# Altium schematic sheet Charger_group2.SchDoc
size A4; SheetNumber: 1; SheetTotal: 1
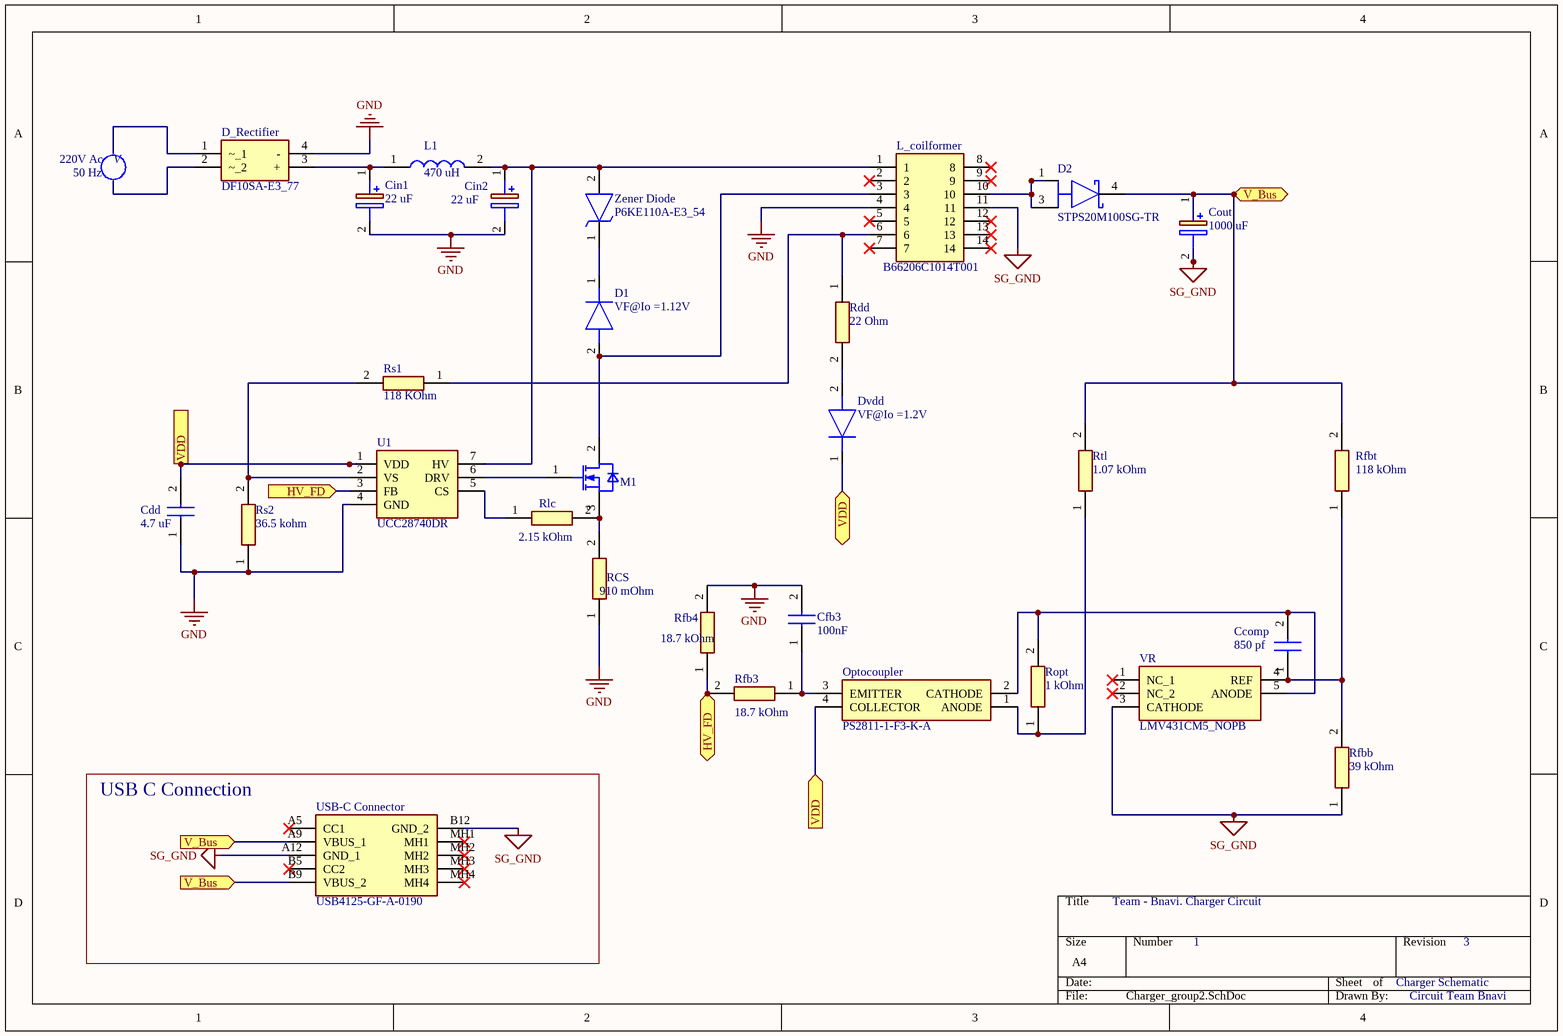
[diagram p0: Charger_group2.SchDoc]

## Parts
Ccomp  850 pf  [CAPC1608X90N]
Cdd  4.7 uF  [CAPC2012X145N]
Cfb3  100nF  [CAPC2013X94N]
Cin1  22 uF  [CAPPRD500W60D1275H2200]
Cin2  22 uF  [CAPPRD500W60D1275H2200]
Cout  1000 uF  [CAPPRD500W65D1000H2700]
D1  VF@Io =1.12V  [DIOM7959X262N]
D2  STPS20M100SG-TR  [FP-STPS20M100SG-TR-MFG]
D_Rectifier  DF10SA-E3_77  [SOP510P1005X330-4N]
Dvdd  VF@Io =1.2V  [DIOM5436X330N]
L1  470 uH  [WE-PD2_105455]
L_coilformer  B66206C1014T001  [B66206C1014T001]
M1  IPD80R1K0CE  [TO229P994X241-3N]  (value not drawn)
Optocoupler  PS2811-1-F3-K-A  [SOIC127P700X210-4N]
RCS  910 mOhm  [RESC2012X60N]
Rdd  22 Ohm  [RESC1608X55N]
Rfb3  18.7 kOhm  [RESC0603X26N]
Rfb4  18.7 kOhm  [RESC0603X26N]
Rfbb  39 kOhm  [RESC1608X55N]
Rfbt  118 kOhm  [RESC1005X40N]
Rlc  2.15 kOhm  [RESC1005X40N]
Ropt  1 kOhm  [RESC1005X40N]
Rs1  118 KOhm  [RESC1005X40N]
Rs2  36.5 kohm  [RESC0603X26N]
Rtl  1.07 kOhm  [RESC1005X40N]
U1  UCC28740DR  [D(R-PDSO-G7)]
USB-C_Connector  USB4125-GF-A-0190  [USB4125GFA0190]
VR  LMV431CM5_NOPB  [SOT95P280X145-5N]
Zener_Diode  P6KE110A-E3_54  [DIOAD1995W86L635D340]

## Blocks framed on the sheet
USB C Connection: USB-C_Connector

## Ports
HV_FD (bidir), HV_FD (in), V_Bus (bidir), V_Bus (in), VDD (bidir), VDD (in)

## Nets
GND: Cdd.1 Cfb3.2(C2) Cin1.2(-) Cin2.2(-) D_Rectifier.4(-) L_coilformer.4 RCS.1 Rfb4.2 Rs2.1 U1.4(GND)
SG_GND: Cout.2(-) L_coilformer.11 Rfbb.1 USB-C_Connector.A12(GND_1) USB-C_Connector.B12(GND_2) VR.3(CATHODE)
HV_FD: Rfb3.2 Rfb4.1 U1.3(FB) ; port HV_FD
V_Bus: Cout.1(+) D2.4(K) Rfbt.2 Rtl.2 USB-C_Connector.A9(VBUS_1) USB-C_Connector.B9(VBUS_2) ; port V_Bus
VDD: Cdd.2 Dvdd.1(K) Optocoupler.4(COLLECTOR) U1.1(VDD) ; port VDD
NetCcomp_1: Ccomp.1 Rfbb.2 Rfbt.1 VR.4(REF)
NetCcomp_2: Ccomp.2 Optocoupler.2(CATHODE) Ropt.2 VR.5(ANODE)
NetCfb3_1: Cfb3.1(C1) Optocoupler.3(EMITTER) Rfb3.1
NetCin1_1: Cin1.1(+) D_Rectifier.3(+) L1.1
NetCin2_1: Cin2.1(+) L1.2 L_coilformer.1 U1.7(HV) Zener_Diode.2(A)
NetD1_1: D1.1(K) Zener_Diode.1(K)
NetD1_2: D1.2(A) L_coilformer.3 M1.2(DRAIN)
NetD2_1: D2.1(A) D2.3(A) L_coilformer.10
NetDvdd_2: Dvdd.2(A) Rdd.2
NetL_coilformer_6: L_coilformer.6 Rdd.1 Rs1.1
NetM1_1: M1.1(GATE) U1.6(DRV)
NetM1_3: M1.3(SOURCE) RCS.2 Rlc.2
NetOptocoupler_1: Optocoupler.1(ANODE) Ropt.1 Rtl.1
NetRlc_1: Rlc.1 U1.5(CS)
NetRs1_2: Rs1.2 Rs2.2 U1.2(VS)

Not connected (* = marked no-connect by the designer): D_Rectifier 1(~_1) 2(~_2); L_coilformer 2* 5* 7* 8* 9* 12* 13* 14*; USB-C_Connector A5(CC1)* B5(CC2)* MH1* MH2* MH3* MH4*; VR 1(NC_1)* 2(NC_2)*

## Notes on the sheet
- 220V Ac
- 50 Hz
- V
- Team - Bnavi. Charger Circuit
- 1
- Charger Schematic
- 3
- Circuit Team Bnavi

## Library data of the parts
Ccomp = 06031C851JAT2A: Capacitor; Manufacturer_Name: AVX; Datasheet Link: https://componentsearchengine.com/Datasheets/1/06031A100FAT2A.pdf; Height: 0.9mm; Manufacturer_Part_Number: 06031C851JAT2A; Mouser Part Number: 581-06031C851JAT2A; Mouser Price/Stock: https://www.mouser.co.uk/ProductDetail/AVX/06031C851JAT2A?qs=Q0wCMCRSJ1uRTlT%2F3ACAEg%3D%3D
Cdd = CGA4J1X7R1V475K125AC: Capacitor; Manufacturer_Name: TDK; Datasheet Link: https://product.tdk.com/system/files/dam/doc/product/capacitor/ceramic/mlcc/catalog/mlcc_automotive_general_en.pdf; Height: 1.45mm; Manufacturer_Part_Number: CGA4J1X7R1V475K125AC; Mouser Part Number: 810-CGA4J1X7R1V475KC; Mouser Price/Stock: https://www.mouser.co.uk/ProductDetail/TDK/CGA4J1X7R1V475K125AC/?qs=xLDY6iXSiQZ6d6YyEJDECQ%3D%3D; Arrow Part Number: CGA4J1X7R1V475K125AC; Arrow Price/Stock: https://www.arrow.com/en/products/cga4j1x7r1v475k125ac/tdk
Cfb3 = 08053C104JAZ2A: Capacitor; Manufacturer_Name: AVX; Manufacturer_Part_Number: 08053C104JAZ2A; Mouser Part Number: 581-08053C104JAZ2A; Mouser Price/Stock: https://www.mouser.co.uk/ProductDetail/AVX/08053C104JAZ2A?qs=YtXa1zY%252Bjw7108MDhSwtdw%3D%3D; Arrow Part Number: 08053C104JAZ2A; Arrow Price/Stock: https://www.arrow.com/en/products/08053c104jaz2a/avx
Cin1 Cin2 = 400PK22MEFC12.5X20: Capacitor Polarised; Manufacturer_Name: Rubycon; Datasheet Link: http://www.rubycon.co.jp/en/catalog/e_pdfs/aluminum/e_pk.pdf; Height: 22mm; Manufacturer_Part_Number: 400PK22MEFC12.5X20; Mouser Part Number: 232-400PK22MEFC125X2; Mouser Price/Stock: https://www.mouser.co.uk/ProductDetail/Rubycon/400PK22MEFC12.5X20?qs=T3oQrply3y%252B1A0DQVCmdTw%3D%3D
Cout = EEU-FC1C102: Capacitor Polarised; Manufacturer_Name: Panasonic; Datasheet Link: http://industrial.panasonic.com/cdbs/www-data/pdf/RDF0000/ABA0000C1209.pdf; Height: 27mm; Manufacturer_Part_Number: EEU-FC1C102; Mouser Part Number: 667-EEU-FC1C102; Mouser Price/Stock: https://www.mouser.co.uk/ProductDetail/Panasonic/EEU-FC1C102/?qs=bcjYS4nEpcecXuFNFyrCMQ%3D%3D; Arrow Part Number: EEU-FC1C102; Arrow Price/Stock: https://www.arrow.com/en/products/eeu-fc1c102/panasonic
D1 = CD214C-F3600: Diode; Manufacturer_Name: Bourns; Datasheet Link: https://datasheet.datasheetarchive.com/originals/distributors/SFDatasheet-7/sf-000140118.pdf; Height: 2.62mm; Manufacturer_Part_Number: CD214C-F3600; Mouser Part Number: 652-CD214C-F3600; Mouser Price/Stock: https://www.mouser.co.uk/ProductDetail/Bourns/CD214C-F3600?qs=TkkmMb5HBbQTesSVRPXLkQ%3D%3D; Arrow Part Number: CD214C-F3600; Arrow Price/Stock: https://www.arrow.com/en/products/cd214c-f3600/bourns
D2 = CMP-12187-000010-1: DIODE SCHOTTKY 100V 20A D2PAK; Manufacturer: STMicroelectronics; Peak Reverse Current: 10uA; Max Junction Temp: +150°C; Standoff Height: 0mm; Max Surge Forward Current: 350A; Forward Current: 20A; Temperature: to +150°C; Device Class L3: Schottky Diodes; Temperature Range High: +150°C; Device Class L1: Discrete Semiconductors; Mouser Description: Schottky Diodes & Rectifiers 20A 100V; Category: Diode; Max Repetitive Reverse Voltage: 100V; ComponentLink2Description: Datasheet; RoHS: TRUE; ComponentLink2URL: https://www.st.com/resource/en/datasheet/stps20m100s.pdf; Octopart: https://octopart.com/stps20m100sg-tr-stmicroelectronics-17669033; Lead Free: Yes; Package: STPS20M100SG-TR; Height: 4.85mm; Device Class L2: Diodes; Automotive: No; Digikey Description: DIODE SCHOTTKY 100V 20A D2PAK; Manufacturer Part Number: STPS20M100SG-TR
D_Rectifier = DF10SA-E3_77: Diode; Manufacturer_Name: Vishay; Manufacturer_Part_Number: DF10SA-E3/77; Datasheet Link: http://uk.rs-online.com/web/p/products/7005403; Height: 3.3mm; Mouser Part Number: 625-DF10SA-E3; Mouser Price/Stock: https://www.mouser.co.uk/ProductDetail/Vishay-General-Semiconductor/DF10SA-E3-77?qs=lTgc38YOCCojApEJ5g6z7g%3D%3D; Arrow Part Number: DF10SA-E3/77; Arrow Price/Stock: https://www.arrow.com/en/products/df10sa-e377/vishay?region=nac
Dvdd = UFS180Je3_TR13: Diode; Manufacturer_Name: Microsemi Corporation; Manufacturer_Part_Number: UFS180Je3/TR13; Datasheet Link: https://media.digikey.com/pdf/Data%20Sheets/Microsemi%20PDFs/UFS160J-UFS180J.pdf; Height: 3.3mm; Mouser Part Number: 494-UFS180JE3/TR13; Mouser Price/Stock: https://www.mouser.co.uk/ProductDetail/Microchip-Microsemi/UFS180Je3-TR13?qs=pU29NIZ4ZwBQwIY5BrOkmA%3D%3D; Arrow Part Number: UFS180JE3/TR13; Arrow Price/Stock: https://www.arrow.com/en/products/ufs180je3tr13/microsemi
L1 = 744776247: Inductor; Manufacturer_Name: Wurth Elektronik; Manufacturer_Part_Number: 744776247; Mouser Part Number: 710-744776247; Mouser Price/Stock: https://www.mouser.com/Search/Refine.aspx?Keyword=710-744776247
L_coilformer = B66206C1014T001: Inductor; Manufacturer_Name: TDK; Datasheet Link: https://product.tdk.com/system/files/dam/doc/product/ferrite/ferrite/ferrite-acc/data_sheet/80/db/fer/e_20_10_6.pdf; Height: 13.9mm; Manufacturer_Part_Number: B66206C1014T001
M1 = IPD80R1K0CE: CoolMos CE 800V Power Transistor; Manufacturer: Infineon Technologies; ManufacturerPartNumber: IPD80R1K0CE; PackageReference: PG-TO252 (DPAK)
Optocoupler = PS2811-1-F3-K-A: Integrated Circuit; Manufacturer_Name: CEL; Datasheet Link: https://datasheet.datasheetarchive.com/originals/distributors/Datasheets_SAMA/e00520b14130937508b53ebe3d73e62e.pdf; Height: 2.1mm; Manufacturer_Part_Number: PS2811-1-F3-K-A; Mouser Part Number: 551-PS2811-1-F3-K-A; Mouser Price/Stock: https://www.mouser.com/Search/Refine.aspx?Keyword=551-PS2811-1-F3-K-A; Arrow Part Number: PS2811-1-F3-K-A; Arrow Price/Stock: https://www.arrow.com/en/products/ps2811-1-f3-k-a/california-eastern-laboratories
RCS = CRM0805-FX-R910ELF: Resistor; Manufacturer_Name: Bourns; Datasheet Link: http://www.bourns.com/data/global/pdfs/CRM0805_1206_2010.pdf; Height: 0.6mm; Manufacturer_Part_Number: CRM0805-FX-R910ELF; Mouser Part Number: 652-CRM0805FXR910ELF; Mouser Price/Stock: https://www.mouser.co.uk/ProductDetail/Bourns/CRM0805-FX-R910ELF?qs=%2FxfeZyN5VBe746z4RDJfyw%3D%3D; Arrow Part Number: CRM0805-FX-R910ELF; Arrow Price/Stock: https://www.arrow.com/en/products/crm0805-fx-r910elf/bourns
Rdd = RC0603FR-0722RL: Resistor; Manufacturer_Name: YAGEO; Datasheet Link: http://www.farnell.com/datasheets/1868787.pdf; Height: 0.55mm; Manufacturer_Part_Number: RC0603FR-0722RL; Mouser Part Number: 603-RC0603FR-0722RL; Mouser Price/Stock: https://www.mouser.co.uk/ProductDetail/YAGEO/RC0603FR-0722RL?qs=diQw95jMAeMOsxb8bne7fg%3D%3D
Rfb3 = RC0201FR-07205KL: Resistor; Manufacturer_Name: YAGEO; Datasheet Link: https://www.arrow.com/en/products/rc0201fr-07205kl/yageo?region=nac; Height: 0.26mm; Manufacturer_Part_Number: RC0201FR-07205KL; Mouser Part Number: 603-RC0201FR-07205KL; Mouser Price/Stock: https://www.mouser.co.uk/ProductDetail/YAGEO/RC0201FR-07205KL?qs=Q4gDqC5t5%2FBvVGk%2FbPsM0A%3D%3D; Arrow Part Number: RC0201FR-07205KL; Arrow Price/Stock: https://www.arrow.com/en/products/rc0201fr-07205kl/yageo?region=nac
Rfb4 = RC0201FR-0718K7L: Resistor; Manufacturer_Name: KEMET; Datasheet Link: https://datasheet.datasheetarchive.com/originals/distributors/Datasheets_SAMA/902f9e387b938f871d31120f5fc1d65e.pdf; Height: 0.26mm; Manufacturer_Part_Number: RC0201FR-0718K7L; Mouser Part Number: 603-RC0201FR-0718K7L; Mouser Price/Stock: https://www.mouser.co.uk/ProductDetail/YAGEO/RC0201FR-0718K7L?qs=Q4gDqC5t5%2FBha9qkI2Bozg%3D%3D; Arrow Part Number: RC0201FR-0718K7L; Arrow Price/Stock: https://www.arrow.com/en/products/rc0201fr-0718k7l/yageo?region=nac
Rfbb = RC0603FR-0739KL: Resistor; Manufacturer_Name: KEMET; Datasheet Link: https://datasheet.datasheetarchive.com/originals/distributors/Datasheets_SAMA/902f9e387b938f871d31120f5fc1d65e.pdf; Height: 0.55mm; Manufacturer_Part_Number: RC0603FR-0739KL; Mouser Part Number: 603-RC0603FR-0739KL; Mouser Price/Stock: https://www.mouser.co.uk/ProductDetail/Yageo/RC0603FR-0739KL?qs=diQw95jMAeOP2wB%2FELd%252BCQ%3D%3D
Rfbt Rs1 = CRCW0402118KFKED: Resistor; Manufacturer_Name: Vishay; Datasheet Link: http://www.vishay.com/docs/20035/dcrcwe3.pdf; Height: 0.4mm; Manufacturer_Part_Number: CRCW0402118KFKED; Mouser Part Number: 71-CRCW0402-118K-E3; Mouser Price/Stock: https://www.mouser.co.uk/ProductDetail/Vishay-Dale/CRCW0402118KFKED?qs=rlE3Te1NifzlSy4FZiG4wQ%3D%3D; Arrow Part Number: CRCW0402118KFKED; Arrow Price/Stock: https://www.arrow.com/en/products/crcw0402118kfked/vishay
Rlc = CRCW04022K15FKED: Resistor; Manufacturer_Name: Vishay; Datasheet Link: http://www.vishay.com/docs/20035/dcrcwe3.pdf; Height: 0.4mm; Manufacturer_Part_Number: CRCW04022K15FKED; Mouser Part Number: 71-CRCW0402-2.15K-E3; Mouser Price/Stock: https://www.mouser.co.uk/ProductDetail/Vishay-Dale/CRCW04022K15FKED?qs=hD42E%2F8yzjpq6GeA3TML6Q%3D%3D; Arrow Part Number: CRCW04022K15FKED; Arrow Price/Stock: https://www.arrow.com/en/products/crcw04022k15fked/vishay
Ropt = CRCW04021K00FKEDHP: Resistor; Manufacturer_Name: Vishay; Datasheet Link: http://www.vishay.com/docs/20035/dcrcwe3.pdf; Height: 0.4mm; Manufacturer_Part_Number: CRCW04021K00FKEDHP; Mouser Part Number: 71-CRCW04021K00FKEDH; Mouser Price/Stock: https://www.mouser.co.uk/ProductDetail/Vishay-Dale/CRCW04021K00FKEDHP?qs=FlFvgi4rxBxFJ5cCIk6dAw%3D%3D; Arrow Part Number: CRCW04021K00FKEDHP; Arrow Price/Stock: https://www.arrow.com/en/products/crcw04021k00fkedhp/vishay?region=nac
Rs2 = RC0201FR-0736K5L: Resistor; Manufacturer_Name: KEMET; Datasheet Link: https://datasheet.datasheetarchive.com/originals/distributors/Datasheets_SAMA/902f9e387b938f871d31120f5fc1d65e.pdf; Height: 0.26mm; Manufacturer_Part_Number: RC0201FR-0736K5L; Mouser Part Number: 603-RC0201FR-0736K5L; Mouser Price/Stock: https://www.mouser.co.uk/ProductDetail/YAGEO/RC0201FR-0736K5L?qs=Q4gDqC5t5%2FCjo5Pvwu9LTQ%3D%3D; Arrow Part Number: RC0201FR-0736K5L; Arrow Price/Stock: https://www.arrow.com/en/products/rc0201fr-0736k5l/yageo?region=nac
Rtl = CRCW04021K07FKED: Resistor; Manufacturer_Name: Vishay; Datasheet Link: http://www.vishay.com/docs/20035/dcrcwe3.pdf; Height: 0.4mm; Manufacturer_Part_Number: CRCW04021K07FKED; Mouser Part Number: 71-CRCW0402-1.07K-E3; Mouser Price/Stock: https://www.mouser.co.uk/ProductDetail/Vishay-Dale/CRCW04021K07FKED?qs=YX%252BK5oaHNYowTrxQlLaSFA%3D%3D; Arrow Part Number: CRCW04021K07FKED; Arrow Price/Stock: https://www.arrow.com/en/products/crcw04021k07fked/vishay
U1 = UCC28740DR: Inductor; Manufacturer_Name: Texas Instruments; Datasheet Link: http://www.ti.com/lit/gpn/ucc28740; Manufacturer_Part_Number: UCC28740DR; Mouser Part Number: 595-UCC28740DR; Mouser Price/Stock: https://www.mouser.co.uk/ProductDetail/Texas-Instruments/UCC28740DR?qs=e1ok2LiJcmZNvNsbUBmieA%3D%3D; Arrow Part Number: UCC28740DR; Arrow Price/Stock: https://www.arrow.com/en/products/ucc28740dr/texas-instruments?region=nac
USB-C_Connector = USB4125-GF-A-0190: Connector; Manufacturer_Name: GCT (GLOBAL CONNECTOR TECHNOLOGY); Datasheet Link: https://eu.mouser.com/datasheet/2/837/usb4125-2448699.pdf; Height: 3.41mm; Manufacturer_Part_Number: USB4125-GF-A-0190; Mouser Part Number: 640-USB4125-GF-A-190; Mouser Price/Stock: https://www.mouser.co.uk/ProductDetail/GCT/USB4125-GF-A-0190?qs=QNEnbhJQKvbCz4hEJBS24w%3D%3D
VR = LMV431CM5_NOPB: Integrated Circuit; Manufacturer_Name: Texas Instruments; Manufacturer_Part_Number: LMV431CM5/NOPB; Datasheet Link: http://www.ti.com/lit/gpn/lmv431; Height: 1.45mm; Mouser Part Number: 926-LMV431CM5/NOPB; Mouser Price/Stock: https://www.mouser.co.uk/ProductDetail/Texas-Instruments/LMV431CM5-NOPB?qs=7lkVKPoqpbYcyASsAAqMsA%3D%3D; Arrow Part Number: LMV431CM5/NOPB; Arrow Price/Stock: https://www.arrow.com/en/products/lmv431cm5nopb/texas-instruments
Zener_Diode = P6KE110A-E3_54: TVS Diode (Uni-directional); Manufacturer_Name: Vishay; Manufacturer_Part_Number: P6KE110A-E3/54; Datasheet Link: https://www.vishay.com/docs/88369/p6ke.pdf; Mouser Part Number: 625-P6KE110A-E3; Mouser Price/Stock: https://www.mouser.co.uk/ProductDetail/Vishay-General-Semiconductor/P6KE110A-E3-54?qs=E3OxquYwg8HE0FmgxCSYSQ%3D%3D; Arrow Part Number: P6KE110A-E3/54; Arrow Price/Stock: https://www.arrow.com/en/products/p6ke110a-e354/vishay